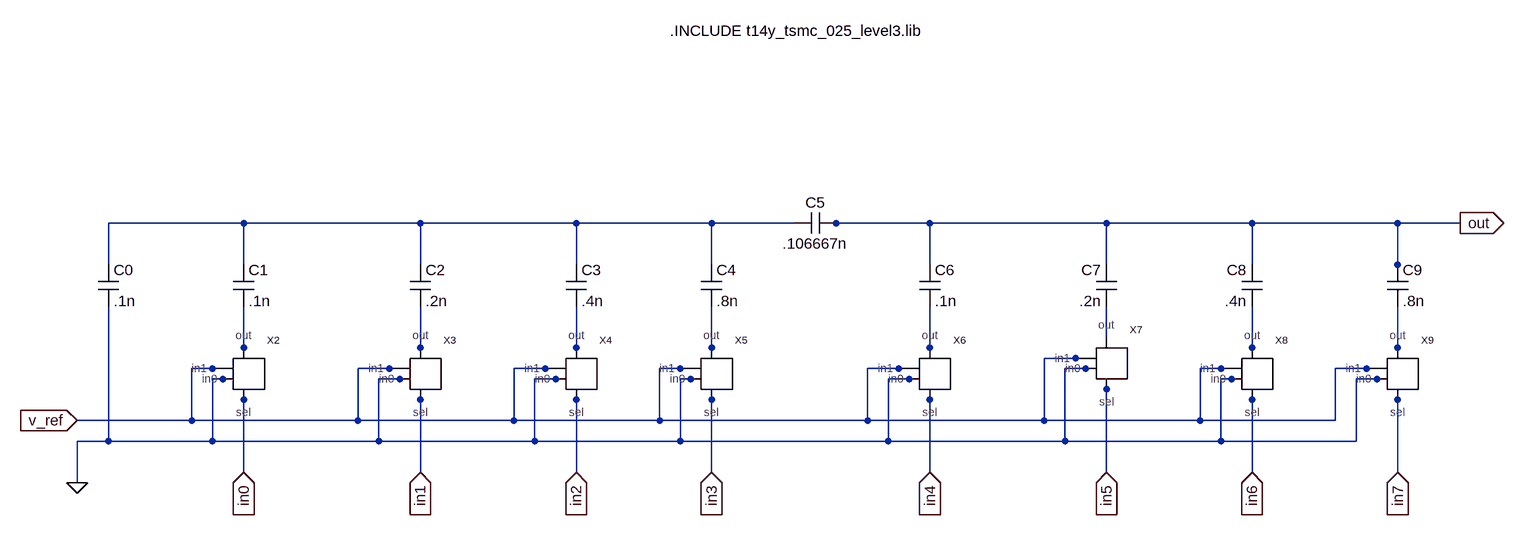
[diagram p0: schematic dac_ckt.asc]
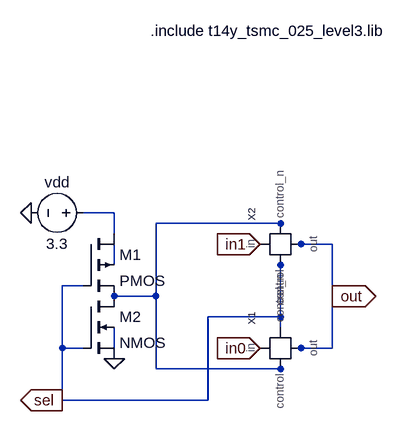
[diagram p1: sub-circuit t_mux.asc]
dac_ckt.asc, the LTspice schematic file:
Version 4
SHEET 1 1884 688
WIRE -368 -48 -576 -48
WIRE -96 -48 -368 -48
WIRE 144 -48 -96 -48
WIRE 352 -48 144 -48
WIRE 480 -48 352 -48
WIRE 544 -48 528 -48
WIRE 688 -48 544 -48
WIRE 960 -48 688 -48
WIRE 1184 -48 960 -48
WIRE 1408 -48 1184 -48
WIRE 1504 -48 1408 -48
WIRE -576 16 -576 -48
WIRE -368 16 -368 -48
WIRE -96 16 -96 -48
WIRE 144 16 144 -48
WIRE 352 16 352 -48
WIRE 688 16 688 -48
WIRE 960 16 960 -48
WIRE 1184 16 1184 -48
WIRE 1408 16 1408 -48
WIRE 1408 32 1408 16
WIRE 960 128 960 80
WIRE -368 144 -368 80
WIRE -96 144 -96 80
WIRE 144 144 144 80
WIRE 352 144 352 80
WIRE 688 144 688 80
WIRE 1184 144 1184 80
WIRE 1408 144 1408 80
WIRE -368 160 -368 144
WIRE -96 160 -96 144
WIRE 144 160 144 144
WIRE 352 160 352 144
WIRE 688 160 688 144
WIRE 912 160 864 160
WIRE 944 160 912 160
WIRE 1184 160 1184 144
WIRE 1408 160 1408 144
WIRE -416 176 -448 176
WIRE -384 176 -416 176
WIRE -144 176 -192 176
WIRE -112 176 -144 176
WIRE 96 176 48 176
WIRE 128 176 96 176
WIRE 304 176 272 176
WIRE 336 176 304 176
WIRE 640 176 592 176
WIRE 672 176 640 176
WIRE 928 176 896 176
WIRE 944 176 928 176
WIRE 1136 176 1104 176
WIRE 1168 176 1136 176
WIRE 1360 176 1312 176
WIRE 1376 176 1360 176
WIRE -400 192 -416 192
WIRE -384 192 -400 192
WIRE -128 192 -160 192
WIRE -112 192 -128 192
WIRE 112 192 80 192
WIRE 128 192 112 192
WIRE 320 192 304 192
WIRE 336 192 320 192
WIRE 656 192 624 192
WIRE 672 192 656 192
WIRE 1152 192 1136 192
WIRE 1168 192 1152 192
WIRE 1376 192 1344 192
WIRE 1392 192 1376 192
WIRE 960 208 960 192
WIRE -368 224 -368 208
WIRE -96 224 -96 208
WIRE 144 224 144 208
WIRE 352 224 352 208
WIRE 688 224 688 208
WIRE 1184 224 1184 208
WIRE 1408 224 1408 208
WIRE -448 256 -448 176
WIRE -448 256 -624 256
WIRE -192 256 -192 176
WIRE -192 256 -448 256
WIRE 48 256 48 176
WIRE 48 256 -192 256
WIRE 272 256 272 176
WIRE 272 256 48 256
WIRE 592 256 592 176
WIRE 592 256 272 256
WIRE 864 256 864 160
WIRE 864 256 592 256
WIRE 1104 256 1104 176
WIRE 1104 256 864 256
WIRE 1312 256 1312 176
WIRE 1312 256 1104 256
WIRE -576 288 -576 80
WIRE -576 288 -624 288
WIRE -416 288 -416 192
WIRE -416 288 -576 288
WIRE -160 288 -160 192
WIRE -160 288 -416 288
WIRE 80 288 80 192
WIRE 80 288 -160 288
WIRE 304 288 304 192
WIRE 304 288 80 288
WIRE 624 288 624 192
WIRE 624 288 304 288
WIRE 896 288 896 176
WIRE 896 288 624 288
WIRE 1136 288 1136 192
WIRE 1136 288 896 288
WIRE 1344 288 1344 192
WIRE 1344 288 1136 288
WIRE -368 336 -368 224
WIRE -96 336 -96 224
WIRE 144 336 144 224
WIRE 352 336 352 224
WIRE 688 336 688 224
WIRE 960 336 960 208
WIRE 1184 336 1184 224
WIRE 1408 336 1408 224
WIRE -624 352 -624 288
FLAG -624 352 0
FLAG 1408 336 in7
IOPIN 1408 336 In
FLAG 1184 336 in6
IOPIN 1184 336 In
FLAG 960 336 in5
IOPIN 960 336 In
FLAG 688 336 in4
IOPIN 688 336 In
FLAG 352 336 in3
IOPIN 352 336 In
FLAG 144 336 in2
IOPIN 144 336 In
FLAG -96 336 in1
IOPIN -96 336 In
FLAG -368 336 in0
IOPIN -368 336 In
FLAG 1504 -48 out
IOPIN 1504 -48 Out
FLAG -624 256 v_ref
IOPIN -624 256 In
SYMBOL cap -384 16 R0
SYMATTR InstName C1
SYMATTR Value .1n
SYMBOL cap -112 16 R0
SYMATTR InstName C2
SYMATTR Value .2n
SYMBOL cap 128 16 R0
SYMATTR InstName C3
SYMATTR Value .4n
SYMBOL cap 336 16 R0
SYMATTR InstName C4
SYMATTR Value .8n
SYMBOL cap 672 16 R0
SYMATTR InstName C6
SYMATTR Value .1n
SYMBOL cap 544 -64 R90
WINDOW 0 0 32 VBottom 2
WINDOW 3 32 32 VTop 2
SYMATTR InstName C5
SYMATTR Value .106667n
SYMBOL cap 976 80 R180
WINDOW 0 24 56 Left 2
WINDOW 3 24 8 Left 2
SYMATTR InstName C7
SYMATTR Value .2n
SYMBOL cap 1200 80 R180
WINDOW 0 24 56 Left 2
WINDOW 3 24 8 Left 2
SYMATTR InstName C8
SYMATTR Value .4n
SYMBOL cap -592 16 R0
SYMATTR InstName C0
SYMATTR Value .1n
SYMBOL t_mux 1408 192 R0
SYMATTR InstName X9
SYMBOL t_mux -368 192 R0
SYMATTR InstName X2
SYMBOL t_mux -96 192 R0
SYMATTR InstName X3
SYMBOL t_mux 144 192 R0
SYMATTR InstName X4
SYMBOL t_mux 352 192 R0
SYMATTR InstName X5
SYMBOL t_mux 688 192 R0
SYMATTR InstName X6
SYMBOL t_mux 960 176 R0
SYMATTR InstName X7
SYMBOL t_mux 1184 192 R0
SYMATTR InstName X8
SYMBOL cap 1392 16 R0
SYMATTR InstName C9
SYMATTR Value .8n
TEXT 288 -344 Left 2 !.INCLUDE t14y_tsmc_025_level3.lib

t_mux.asc, the sub-circuit schematic file:
Version 4
SHEET 1 880 680
WIRE -32 80 -80 80
WIRE 224 96 32 96
WIRE -32 112 -32 80
WIRE 224 112 224 96
WIRE 208 128 192 128
WIRE 256 128 240 128
WIRE 304 128 256 128
WIRE -32 160 -32 128
WIRE 224 160 224 144
WIRE -80 192 -112 192
WIRE 32 208 32 96
WIRE 32 208 -32 208
WIRE 304 208 304 128
WIRE 224 240 224 160
WIRE 224 240 112 240
WIRE 224 256 224 240
WIRE -112 288 -112 192
WIRE -80 288 -112 288
WIRE -32 288 -32 256
WIRE 208 288 192 288
WIRE 256 288 240 288
WIRE 304 288 304 208
WIRE 304 288 256 288
WIRE 32 320 32 208
WIRE 224 320 224 304
WIRE 224 320 32 320
WIRE -112 368 -112 288
WIRE 112 368 112 240
WIRE 112 368 -112 368
FLAG -160 80 0
FLAG -32 304 0
FLAG 192 128 in1
IOPIN 192 128 In
FLAG 192 288 in0
IOPIN 192 288 In
FLAG 304 208 out
IOPIN 304 208 Out
FLAG -112 368 sel
IOPIN -112 368 Out
SYMBOL pmos4 -80 112 R0
SYMATTR InstName M1
SYMATTR Value2 l=250n w=40u m=200
SYMBOL nmos4 -80 208 R0
SYMATTR InstName M2
SYMATTR Value2 l=250n w=20u m=200
SYMBOL voltage -64 80 R90
WINDOW 0 -32 56 VBottom 2
WINDOW 3 32 56 VTop 2
WINDOW 123 0 0 Left 0
WINDOW 39 0 0 Left 0
SYMATTR InstName vdd
SYMATTR Value 3.3
SYMBOL tg_gate 224 288 R270
SYMATTR InstName X1
SYMBOL tg_gate 224 128 R270
SYMATTR InstName X2
TEXT 24 -200 Left 2 !.include t14y_tsmc_025_level3.lib

The netlist it stands for:
* dac_ckt.asc
C1 N001 N003 .1n
C2 N001 N004 .2n
C3 N001 N005 .4n
C4 N001 N006 .8n
C6 out N007 .1n
C5 out N001 .106667n
C7 N002 out .2n
C8 N008 out .4n
C0 N001 0 .1n
XX9 N009 in7 v_ref 0 t_mux
XX2 N003 in0 v_ref 0 t_mux
XX3 N004 in1 v_ref 0 t_mux
XX4 N005 in2 v_ref 0 t_mux
XX5 N006 in3 v_ref 0 t_mux
XX6 N007 in4 v_ref 0 t_mux
XX7 N002 in5 v_ref 0 t_mux
XX8 N008 in6 v_ref 0 t_mux
C9 out N009 .8n

* block symbol definitions
.subckt t_mux out sel in1 in0
M1 N001 sel N002 N003 PMOS l=250n w=40u m=200
M2 N002 sel 0 N004 NMOS l=250n w=20u m=200
vdd N001 0 3.3
XX1 in0 out N002 sel tg_gate  ; pins in out control control_n
XX2 in1 out sel N002 tg_gate  ; pins in out control control_n
.include t14y_tsmc_025_level3.lib
.ends t_mux

.model NMOS NMOS
.model PMOS PMOS
.lib standard.mos
.INCLUDE t14y_tsmc_025_level3.lib
.backanno
.end